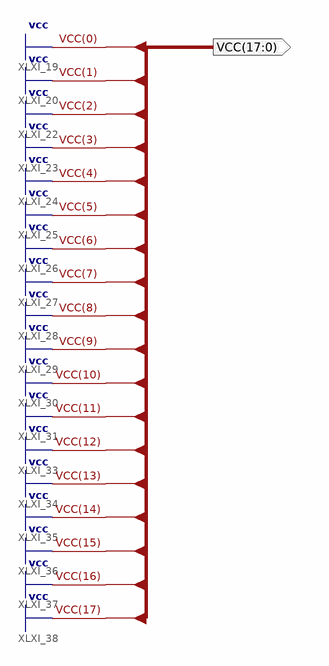
[diagram p0: schematic sheet 1]
// Xilinx ISE schematic vcc18.sch (spartan6) as structural Verilog: 0 symbols, 1 ports
module vcc18 (
  output [17:0] VCC
);


  assign VCC = {18{1'b1}};
endmodule
